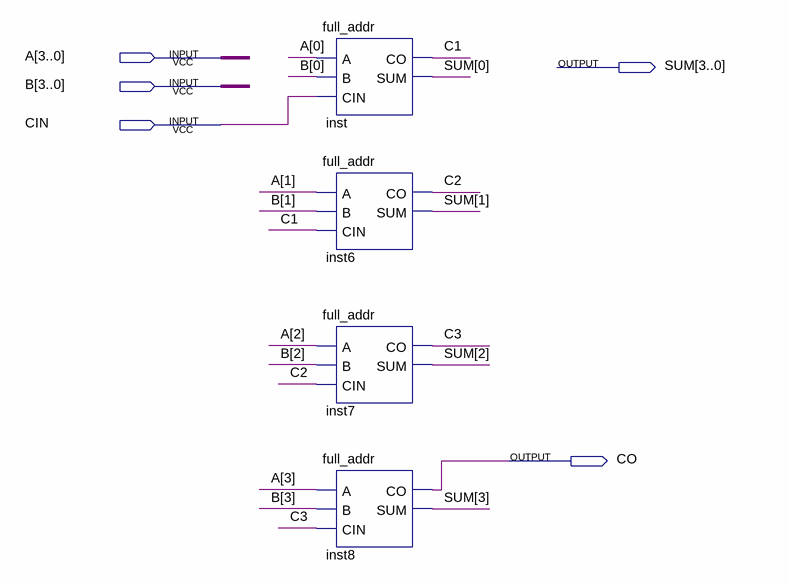
[diagram p0: schematic sheet]
// Quartus schematic m_faddr.bdf as structural Verilog: 4 symbols, 5 pins
module m_faddr (
  input  [3:0] A,
  input  [3:0] B,
  input  CIN,
  output [3:0] SUM,
  output CO
);

  wire C1, C2, C3;

  full_addr inst (.A(A[0]), .B(B[0]), .CIN(CIN), .CO(C1), .SUM(SUM[0]));
  full_addr inst6 (.A(A[1]), .B(B[1]), .CIN(C1), .CO(C2), .SUM(SUM[1]));
  full_addr inst7 (.A(A[2]), .B(B[2]), .CIN(C2), .CO(C3), .SUM(SUM[2]));
  full_addr inst8 (.A(A[3]), .B(B[3]), .CIN(C3), .CO(CO), .SUM(SUM[3]));
endmodule
